# Altium schematic sheet Sheet2-USB.SchDoc
size A3; SheetNumber: 3; SheetTotal: 3
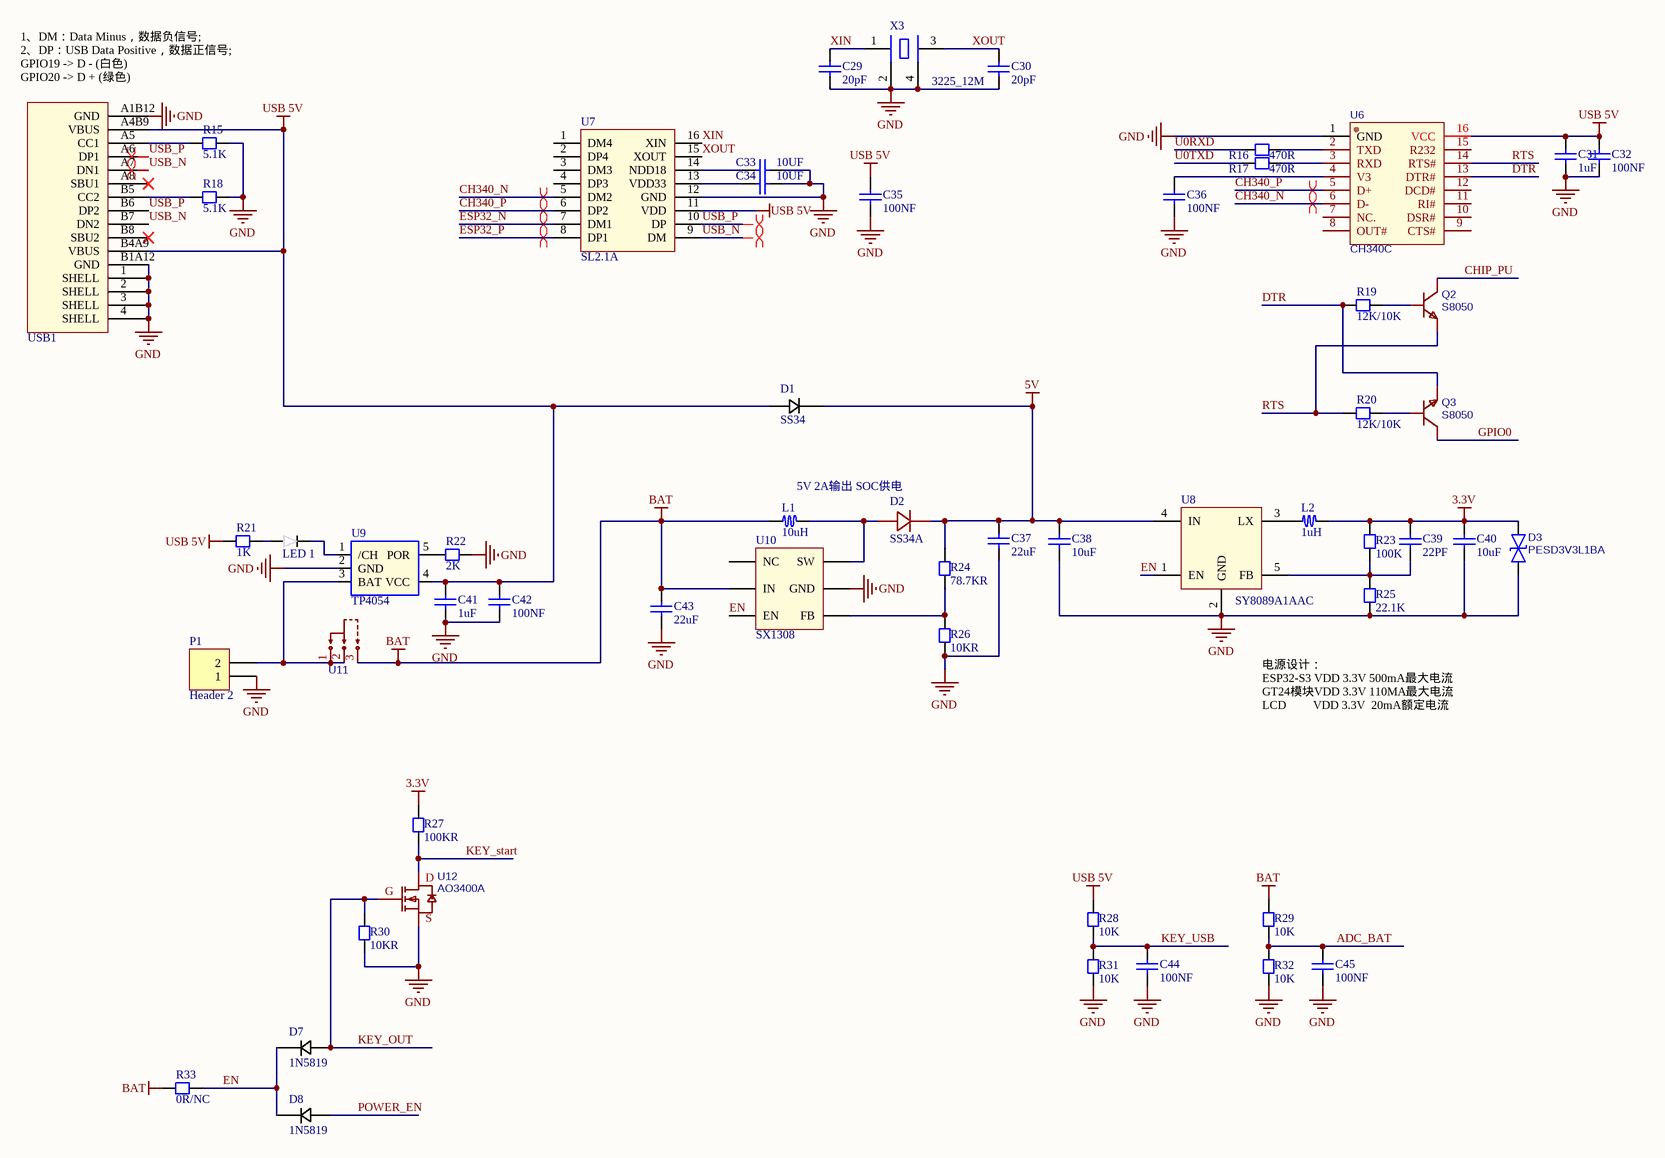
[diagram p0: Sheet2-USB.SchDoc]

## Parts
C29  20pF  [CC1608-0603]
C30  20pF  [CC1608-0603]
C31  1uF  [CC1608-0603]
C32  100NF  [CC1608-0603]
C33  10UF  [CC1608-0603]
C34  10UF  [CC1608-0603]
C35  100NF  [CC1608-0603]
C36  100NF  [CC1608-0603]
C37  22uF  [CC1608-0603]
C38  10uF  [CC1608-0603]
C39  22PF  [CC1608-0603]
C40  10uF  [CC1608-0603]
C41  1uF  [CC1608-0603]
C42  100NF  [CC1608-0603]
C43  22uF  [CC1608-0603]
C44  100NF  [CC1608-0603]
C45  100NF  [CC1608-0603]
D1  SS34  [DO-214 AA]
D2  SS34A  [DO-214 AA SMB]
D3  PESD3V3L1BA  [SOD-323]
D7  1N5819  [SOD-323_L1.8-W1.3-LS2.5-RD]
D8  1N5819  [SOD-323_L1.8-W1.3-LS2.5-RD]
L1  10uH  [Inductor-6045]
L2  1uH  [Inductor-4018]
LED_1  LED 0603  [LED 0603]  (value not drawn)
P1  Header 2  [HX2.54-2]
Q2  S8050  [SOT-23]
Q3  S8050  [SOT-23]
R15  5.1K  [CR1608-0603]
R16  470R  [CR1608-0603]
R17  470R  [CR1608-0603]
R18  5.1K  [CR1608-0603]
R19  12K/10K  [CR1608-0603]
R20  12K/10K  [CR1608-0603]
R21  1K  [CR1608-0603]
R22  2K  [CR1608-0603]
R23  100K  [CR1608-0603]
R24  78.7KR  [CR1608-0603]
R25  22.1K  [CR1608-0603]
R26  10KR  [CR1608-0603]
R27  100KR  [CR1608-0603]
R28  10K  [CR1608-0603]
R29  10K  [CR1608-0603]
R30  10KR  [CR1608-0603]
R31  10K  [CR1608-0603]
R32  10K  [CR1608-0603]
R33  0R/NC  [CR1608-0603]
U6  CH340C  [SOP-16]
U7  SL2.1A  [SOP-16]
U8  SY8089A1AAC  [SOT23-5]
U9  TP4054  [SOT23-5]
U10  SX1308  [SOT23-6]
U11  HX SS12D10G4  [SW-TH_3P-SS12D06]  (value not drawn)
U12  AO3400A  [SOT-23]
USB1  Tpye-c 16P  [TYPE-C 16P]  (value not drawn)
X3  3225_12M  [XTAL-3225]

## Nets
3.3V: C39.2 C40.2 D3.1 L2.2 R23.1 R27.2
5V: C37.1 C38.2 D1.1(K) D2.1(C) R24.2 U8.4(IN)
BAT: C43.2 L1.1 R29.2 R33.1 U10.5(IN) U11.3
GND: C29.1 C30.1 C31.1 C32.1 C33.1 C34.1 C35.1 C36.1 C37.2 C38.1 C40.1 C41.1 C42.1 C43.1 C44.1 C45.1 D3.2 P1.1 R15.1 R18.1 R22.2 R25.2 R26.1 R30.1 R31.1 R32.1 U6.1(GND) U7.12(GND) U8.2(GND) U9.2(GND) U10.2(GND) U12.2(S) USB1.1(SHELL) USB1.2(SHELL) USB1.3(SHELL) USB1.4(SHELL) USB1.A1B12(GND) USB1.B1A12(GND) X3.2(GND) X3.4(GND)
USB 5V: C31.2 C32.2 C35.2 C41.2 C42.2 D1.2(A) R21.1 R28.2 U6.16(VCC) U7.11(VDD) U9.4(VCC) USB1.A4B9(VBUS) USB1.B4A9(VBUS)
ADC_BAT: C45.2 R29.1 R32.2
CH340_N: U6.6(D-) U7.5(DM2)
CH340_P: U6.5(D+) U7.6(DP2)
CHIP_PU: Q2.3(C)
DTR: Q3.2(E) R19.1 U6.13(DTR#)
EN: D7.1 D8.1 R33.2 U8.1(EN) U10.4(EN)
ESP32_N: U7.7(DM1)
ESP32_P: U7.8(DP1)
GPIO0: Q3.3(C)
KEY_OUT: D7.2 R30.2 U12.1(G)
KEY_start: R27.1 U12.3(D)
KEY_USB: C44.2 R28.1 R31.2
POWER_EN: D8.2
RTS: Q2.2(E) R20.1 U6.14(RTS#)
U0RXD: R16.2
U0TXD: R17.2
USB_N: U7.9(DM) USB1.A7(DN1) USB1.B7(DN2)
USB_P: U7.10(DP) USB1.A6(DP1) USB1.B6(DP2)
XIN: C29.2 U7.16(XIN) X3.1(OSC1)
XOUT: C30.2 U7.15(XOUT) X3.3(OSC2)
NetC33_2: C33.2 U7.14(NDD18)
NetC34_2: C34.2 U7.13(VDD33)
NetC36_2: C36.2 U6.4(V3)
NetC39_1: C39.1 R23.2 R25.1 U8.5(FB)
NetD2_2: D2.2(A) L1.2 U10.1(SW)
NetL2_1: L2.1 U8.3(LX)
NetLED_1_1: LED_1.1 R21.2
NetLED_1_2: LED_1.2 U9.1(/CH)
NetP1_2: P1.2 U9.3(BAT) U11.1 U11.2
NetQ2_1: Q2.1(B) R19.2
NetQ3_1: Q3.1(B) R20.2
NetR15_2: R15.2 USB1.A5(CC1)
NetR16_1: R16.1 U6.2(TXD)
NetR17_1: R17.1 U6.3(RXD)
NetR18_2: R18.2 USB1.B5(CC2)
NetR22_1: R22.1 U9.5(POR)
NetR24_1: R24.1 R26.2 U10.3(FB)

Not connected (* = marked no-connect by the designer): U6 7(NC.) 8(OUT#) 9(CTS#) 10(DSR#) 11(RI#) 12(DCD#) 15(R232); U7 1(DM4) 2(DP4) 3(DM3) 4(DP3); U10 6(NC); USB1 A8(SBU1)* B8(SBU2)*

## Layout directives
differential pair: CH340_N, CH340_P, ESP32_N, ESP32_P, USB_N, USB_P

## Notes on the sheet
- (near USB1) 1、DM：Data Minus，数据负信号;
  2、DP：USB Data Positive，数据正信号;
  GPIO19 -> D - (白色)
  GPIO20 -> D + (绿色)
- 5V 2A输出 SOC供电
- 电源设计：
  ESP32-S3 VDD 3.3V 500mA最大电流
  GT24模块VDD 3.3V 110MA最大电流
  LCD         VDD 3.3V  20mA额定电流

## Library data of the parts
C29-C36 C38-C45 = Cap Chip 0603: 0603封装的电容; Published: 8-Jun-2000; Revision: July-2002: Re-released for DXP Platform.; Publisher: Altium Limited
C37 = Chip capacitor: 贴片电容
D1 = SS34: 肖特基二极管
D2 = SS34A: 大电流肖特基二极管，5A/40V
D3 = PESD3V3L1BA: SOD-323 3.3V 双向ESD防静电二极管保护芯片; Manufacturer: MDD; Manufacturer Part: SMAJ6.5CA; Supplier: LCSC; Supplier Part: C110041; JLCPCB Part Class: Extended Part; spicePre: D; spiceSymbolName: SMAJ6.5CA-C110041
D7 D8 = 1N5819: 肖特基二极管
L1 = Inductor-6045: 6045封装 线绕SMD功率电感
L2 = Inductor-4018: 贴片电感 1206封装
P1 = Header 2: Header, 2-Pin; LatestRevisionDate: 17-Jul-2002; LatestRevisionNote: Re-released for DXP Platform.; Publisher: Altium Limited
Q2 Q3 = S8050: Manufacturer: SALLTECH(萨瑞); Contributor: lcsc; Supplier: LCSC; Supplier Part: C3027096; Manufacturer Part: S8050; spicePre: Q; spiceSymbolName: S8050_C3027096
R15-R23 R25 R28 R29 R31-R33 = Resistor Chip 0603: 0603封装电阻; Published: 8-Jun-2000; Revision: July-2002: Re-released for DXP Platform.; Publisher: Altium Limited
R24 R26 R27 R30 = Chip resistor: 贴片电阻
U6 = CH340C: Manufacturer: WCH(南京沁恒); Supplier: LCSC; Manufacturer Part: CH340C; Supplier Part: C84681; JLCPCB Part Class: Extended Part; spicePre: U; spiceSymbolName: CH340C
U7 = SL2.1A: USB HUB 四拓展
U8 = SY8089A1AAC: SY8089A1是一种高效率的1.5MHz同步降压DC/DC稳压器，能够提供高达输出电流2A。它可以在2.5V到5.5V的宽输入电压范围内工作，集成了主开关和同步开关，具有极低的RDS(ON)，最大限度地减少了导通损耗。 / 输出电压纹波小，外接电感小，电容器尺寸小 / 1.5MHz开关频率。
U9 = TP4054: 迷你充电IC SOT-23-5
U10 = SX1308: SOT23-6 升压芯片
U11 = SW-TH_3P-SS12D06: BOM_Manufacturer: hanxia(韩下); Contributor: lcsc; BOM_Supplier: LCSC; BOM_Supplier Part: C5149841; BOM_Manufacturer Part: HX SS12D10G4; link: https://atta.szlcsc.com/upload/public/pdf/source/20220907/2020D7183ED16DD6E2B9F5A13FB144CF.pdf; BOM_JLCPCB Part Class: Extended Part; spicePre: U; spiceSymbolName: HX SS12D10G4
U12 = AO3400A: UMW AO3400A SOT-23 30V/5.8A N沟道 MOS(场效应管)芯片; Manufacturer: ElecSuper(静芯微）; Manufacturer Part: AO3401A; Contributor: lcsc; Supplier: LCSC; Supplier Part: C5224202; JLCPCB Part Class: Extended Part; link: https://so.szlcsc.com/global.html?k=C5224202&ref=editor; spicePre: U; spiceSymbolName: AO3401A_C5224202
USB1 = Tpye-c 16P: 16P 封装的TYPE -c接口 4固定插脚 双向
X3 = XTAL 3225: 3225封装的晶振